# Altium schematic sheet MP2359_3.3V.SchDoc
size A4
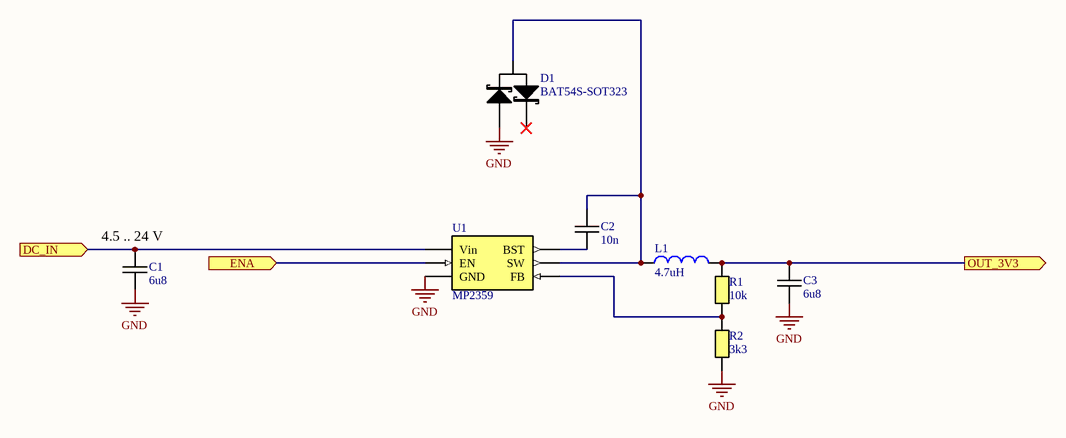
[diagram p0: MP2359_3.3V.SchDoc]

## Parts
C1  6u8  [CAPC0805(2012)75_N]
C2  10n  [CAPC0603(1608)55_N]
C3  6u8  [CAPC0805(2012)75_N]
D1  BAT54S-SOT323  [SOT323-123]
L1  Inductance: 4.7uH  [C_1210]  (hidden comment: IND)
R1  10k  [RESC0805(2012)_N]
R2  3k3  [RESC0805(2012)_N]
U1  MP2359  [TSOP23-6]

## Ports
DC_IN (in), ENA (in), OUT_3V3 (out)

## Nets
GND: C1.2 C3.2 D1.1 R2.1 U1.2(GND)
DC_IN: C1.1 U1.5(Vin) ; port DC_IN
ENA: U1.4(EN) ; port ENA
OUT_3V3: C3.1 L1.2 R1.2 ; port OUT_3V3
NetC2_1: C2.1 U1.1(BST)
NetC2_2: C2.2 D1.3 L1.1 U1.6(SW)
NetR1_1: R1.1 R2.2 U1.3(FB)

Not connected (* = marked no-connect by the designer): D1 2*

## Notes on the sheet
- (near C1) 4.5 .. 24 V

## Library data of the parts
C1-C3 = Capacitor M: Ceramic capacitor Medium density
  C1 C3: Value: 6u8
  C2: Value: 10n
D1 = BAT54S-SOT323: DUAL SCHOTTKY DIODE SERIES; Manufacturer: NXP Semiconductors; Manufacturer Part Number: BAT54SW,115; Voltage - Forward (Vf) (Max) @ If: 800mV @ 100mA; Current - Reverse Leakage @ Vr: 2µA @ 25V; Speed: Small Signal =< 200mA (Io), Any Speed; Diode Configuration: 1 Pair Series Connection; Current - Average Rectified (Io) (per Diode): 200mA (DC); Voltage - DC Reverse (Vr) (Max): 30V; Reverse Recovery Time (trr): 5ns; Supplier 1: Digi-Key; Supplier Part Number 1: 568-1615-2-ND; Mounting Type: Surface Mount; Packaging: Tape & Reel (TR); Package / Case: SC-70-3, SOT-323-3; Diode Type: Schottky; Supplier Part Number: 568-1615-2-ND; Category: Discrete Semiconductor Products; Supplier: Digi-Key; RoHS: RoHS Compliant
L1 = Inductor
R1 R2 = Resistor M: Resistor Medium Density
  R1: Value: 10k
  R2: Value: 3k3
U1 = MP2359: monolithic step-down switch  mode converter with a built-in power MOSFET; Supply Voltage VIN: 4.5V - 24V; Output Voltage VOUT: 0.81V to 15V; Peak Output Current: 1.2A; Frequency: 1.4MHz